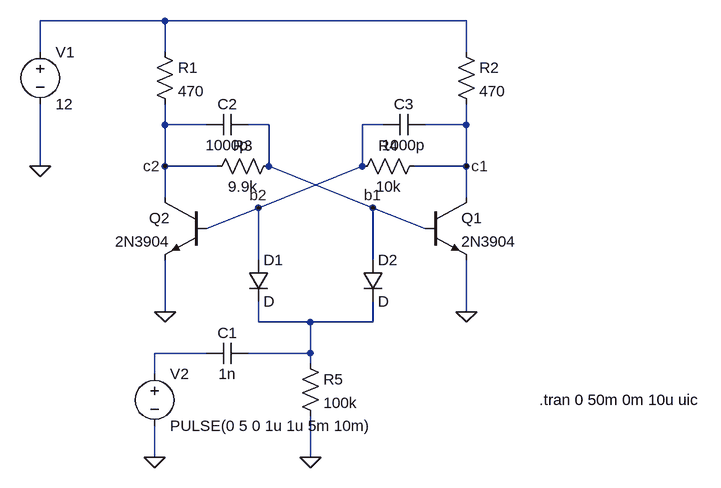
[diagram p0: schematic Bistable_CB.asc]
Bistable_CB.asc, the LTspice schematic file:
Version 4
SHEET 1 880 680
WIRE -144 -160 -336 -160
WIRE 320 -160 -144 -160
WIRE -336 -112 -336 -160
WIRE -144 -112 -144 -160
WIRE 320 -112 320 -160
WIRE -144 0 -144 -32
WIRE -80 0 -144 0
WIRE 16 0 -16 0
WIRE 192 0 160 0
WIRE 320 0 320 -32
WIRE 320 0 256 0
WIRE -336 64 -336 -32
WIRE -144 64 -144 0
WIRE -64 64 -144 64
WIRE 16 64 16 0
WIRE 160 64 160 0
WIRE 320 64 320 0
WIRE 320 64 240 64
WIRE -144 112 -144 64
WIRE 320 112 320 64
WIRE 0 128 160 64
WIRE 176 128 16 64
WIRE -80 160 0 128
WIRE 256 160 176 128
WIRE 0 208 0 128
WIRE 176 208 176 128
WIRE -144 288 -144 208
WIRE 320 288 320 208
WIRE 0 304 0 272
WIRE 80 304 0 304
WIRE 176 304 176 272
WIRE 176 304 80 304
WIRE -80 352 -160 352
WIRE 80 352 80 304
WIRE 80 352 -16 352
WIRE 80 368 80 352
WIRE -160 384 -160 352
WIRE -160 512 -160 464
WIRE 80 512 80 448
FLAG -336 64 0
FLAG -144 288 0
FLAG 320 288 0
FLAG 320 64 c1
FLAG -144 64 c2
FLAG 176 128 b1
FLAG 0 128 b2
FLAG 80 512 0
FLAG -160 512 0
SYMBOL npn 256 112 R0
SYMATTR InstName Q1
SYMATTR Value 2N3904
SYMBOL npn -80 112 M0
SYMATTR InstName Q2
SYMATTR Value 2N3904
SYMBOL res -160 -128 R0
SYMATTR InstName R1
SYMATTR Value 470
SYMBOL res 304 -128 R0
SYMATTR InstName R2
SYMATTR Value 470
SYMBOL res 32 48 R90
WINDOW 0 0 56 VBottom 2
WINDOW 3 32 56 VTop 2
SYMATTR InstName R3
SYMATTR Value 9.9k
SYMBOL res 256 48 R90
WINDOW 0 0 56 VBottom 2
WINDOW 3 32 56 VTop 2
SYMATTR InstName R4
SYMATTR Value 10k
SYMBOL voltage -336 -128 R0
WINDOW 123 0 0 Left 2
WINDOW 39 0 0 Left 2
SYMATTR InstName V1
SYMATTR Value 12
SYMBOL diode -16 208 R0
SYMATTR InstName D1
SYMBOL diode 160 208 R0
SYMATTR InstName D2
SYMBOL res 64 352 R0
SYMATTR InstName R5
SYMATTR Value 100k
SYMBOL cap -16 336 R90
WINDOW 0 0 32 VBottom 2
WINDOW 3 32 32 VTop 2
SYMATTR InstName C1
SYMATTR Value 1n
SYMBOL voltage -160 368 R0
WINDOW 123 0 0 Left 2
WINDOW 39 0 0 Left 2
SYMATTR InstName V2
SYMATTR Value PULSE(0 5 0 1u 1u 5m 10m)
SYMBOL cap -16 -16 R90
WINDOW 0 0 32 VBottom 2
WINDOW 3 32 32 VTop 2
SYMATTR InstName C2
SYMATTR Value 1000p
SYMBOL cap 256 -16 R90
WINDOW 0 0 32 VBottom 2
WINDOW 3 32 32 VTop 2
SYMATTR InstName C3
SYMATTR Value 1000p
TEXT 432 424 Left 2 !.tran 0 50m 0m 10u uic

The netlist it stands for:
* Bistable_CB.asc
Q1 c1 b1 0 0 2N3904
Q2 c2 b2 0 0 2N3904
R1 N001 c2 470
R2 N001 c1 470
R3 b1 c2 9.9k
R4 c1 b2 10k
V1 N001 0 12
D1 b2 N002 D
D2 b1 N002 D
R5 N002 0 100k
C1 N002 N003 1n
V2 N003 0 PULSE(0 5 0 1u 1u 5m 10m)
C2 b1 c2 1000p
C3 c1 b2 1000p
.model D D
.lib standard.dio
.model NPN NPN
.model PNP PNP
.lib standard.bjt
.tran 0 50m 0m 10u uic
.backanno
.end